# EAGLE design rtc_version1 (EAGLE 5.11)
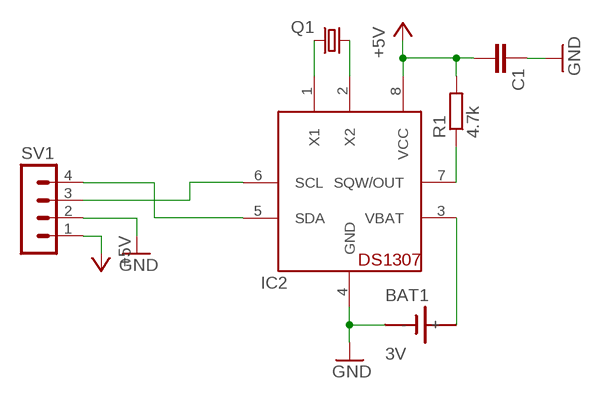
[diagram p0: schematic, sheet 1]

## Parts
BAT1  3V  SN2032  [SN2032]
C1  CAPPTH2  [CAP-PTH-SMALL2]
IC2  DS1307  [DIL08]
Q1  CRYSTALTC38H  [TC38H]
R1  4.7k  R-EU_0207/7  [0207/7]
SV1  MA04-1  [MA04-1]

## Nets
+5V: C1.2 IC2.8(VCC) R1.2 SV1.1
GND: BAT1.- C1.1 IC2.4(GND) SV1.2
N$1: IC2.2(X2) Q1.1
N$2: IC2.1(X1) Q1.2
N$3: BAT1.+ IC2.3(VBAT)
N$5: IC2.7(SQW/OUT) R1.1
SCL: IC2.6(SCL) SV1.3
SDA: IC2.5(SDA) SV1.4

## Library data of the parts
BAT1 = sn2032:SN2032: LI BATTERY
C1 = SparkFun:CAP: Capacitor Standard 0603 ceramic capacitor, and 0.1" leaded capacitor.
IC2 = adafruit:DS1307: DS1307 Real time clock (RTC) with battery backup ability. Talk to it via i2c
Q1 = SparkFun:CRYSTAL: Crystals Various standard crystals. Proven footprints. Spark Fun Electronics SKU : COM-00534
R1 = rcl:R-EU_: RESISTOR, European symbol
SV1 = con-lstb:MA04-1: PIN HEADER; OC_FARNELL: unknown; OC_NEWARK: unknown

## Board
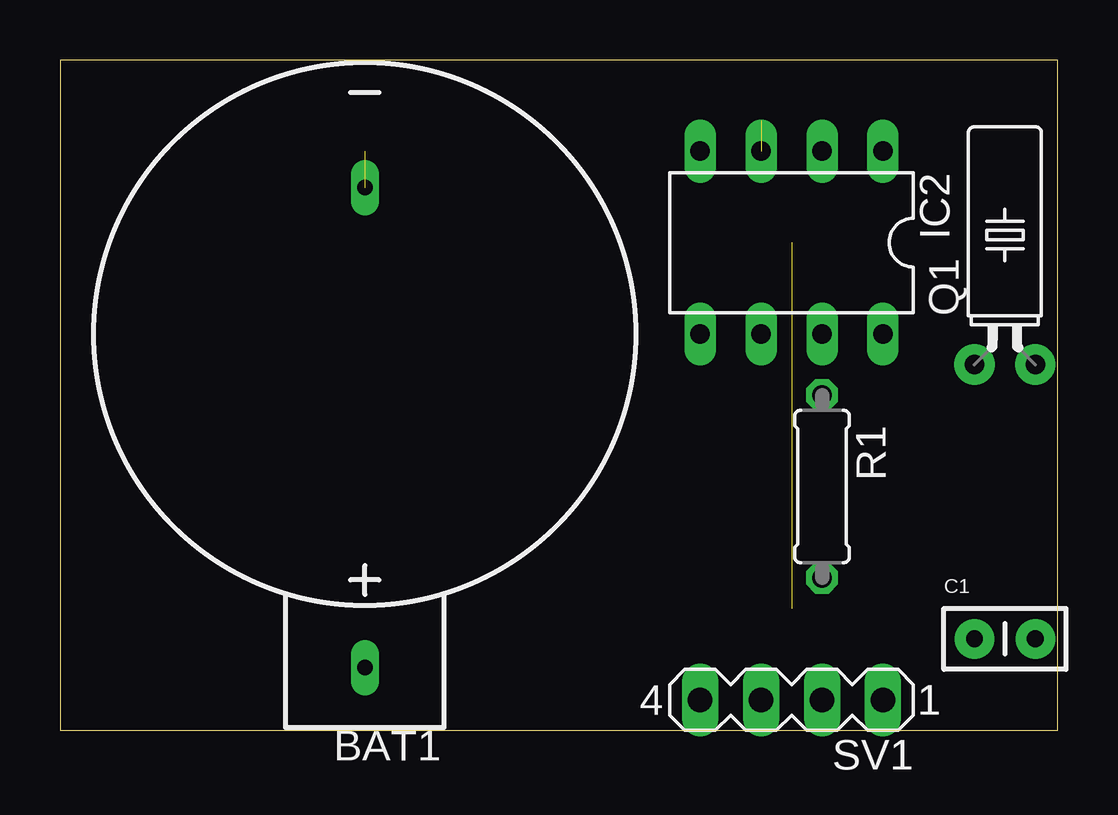
[diagram p1: board, top side]
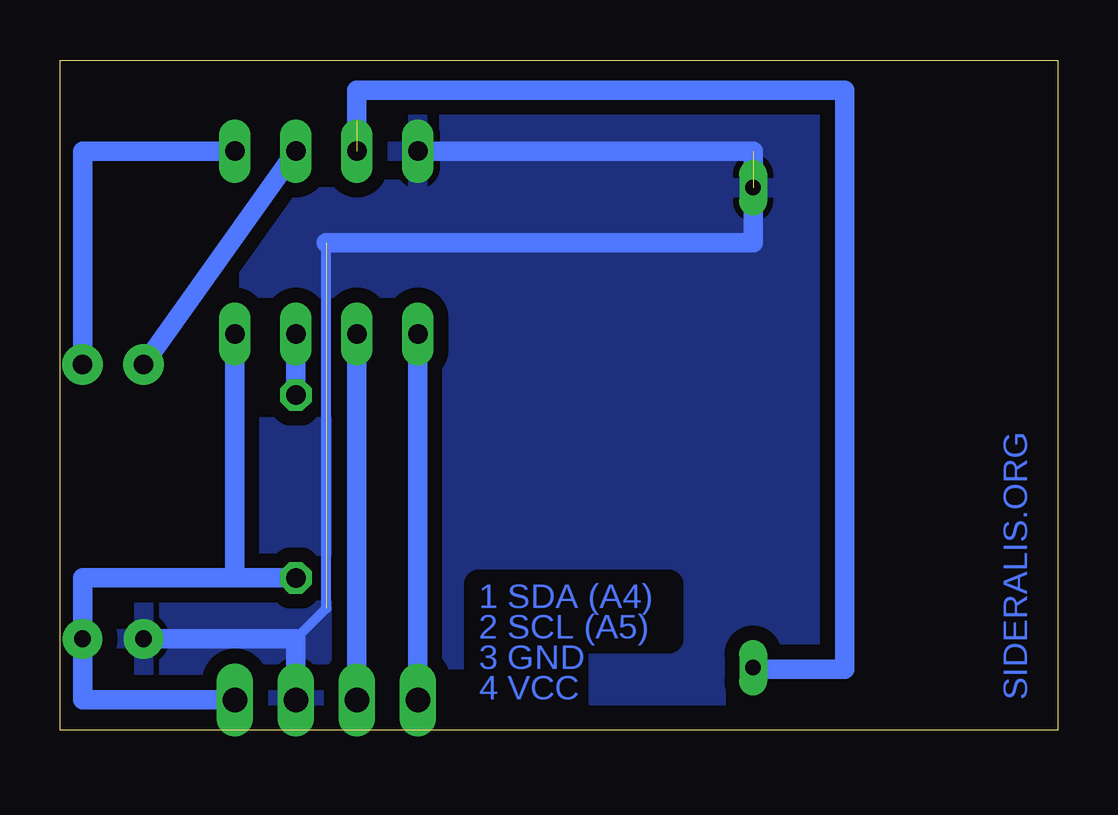
[diagram p2: board, bottom side, seen from below]

Size 41.58 x 27.93 mm. Coordinates in mm from the lower left corner, seen from the top.
Outline: 0,0 41.58,0 41.58,27.93 0,27.93 0,0
Copper layers (1*16): Top 0.035mm / dielectric 1.5mm / Bottom 0.035mm
Design rules "default": minimum track width 10mil, minimum drill 24mil, track to track 8mil, track to pad 8mil, pad to pad 8mil, via to via 8mil, smd to smd 8mil, copper to edge 40mil, drill to drill 8mil, minimum pad ring 10mil, minimum via ring 8mil, stop-mask expansion 4mil, vias tented up to drill 0mil, thermal gap 10mil

### Footprints (pad centres in the part's own frame; a part is rotated, then mirrored left to right if it is on the bottom)
SN2032 = drill 0.65 long: + 0,13.9; - 0,-6.1
CAP-PTH-SMALL2 = drill 0.7 pad 1.651 round: 1 0,0; 2 2.54,0
DIL08 = drill 0.813 long: 1 -3.81,-3.81; 2 -1.27,-3.81; 3 1.27,-3.81; 4 3.81,-3.81; 5 3.81,3.81; 6 1.27,3.81; 7 -1.27,3.81; 8 -3.81,3.81
TC38H = drill 0.813 pad 1.676 round: 1 -1.27,0; 2 1.27,0
0207/7 = drill 0.813 octagon: 1 -3.81,0; 2 3.81,0
MA04-1 = drill 1.016 long: 1 -3.81,0; 2 -1.27,0; 3 1.27,0; 4 3.81,0

### Placement (x,y rotation side)
BAT1  12.7,16.51 180 top
C1  38.1,3.81 0 top
IC2  30.48,20.32 180 top
Q1  39.37,15.24 0 top
R1  31.75,10.16 270 top
SV1  30.48,1.27 180 top

### Tracks (layer width: path | path; a pad name or v marks a point on that pad's centre or on a via)
+5V
  Bottom 0.813: 34.29,6.35 IC2.8 | 34.29,6.35 R1.2 | 34.29,6.35 40.64,6.35 C1.2 40.64,1.27 SV1.1
GND  (2 unrouted)
  Bottom 0.406: 31.75,3.81 30.48,5.08 30.48,20.32
  Bottom 0.813: IC2.4 12.7,24.13 12.7,20.32 30.48,20.32 | SV1.2 31.75,3.81 C1.1
  pour Bottom (isolate 0.61): -8.89,38.1 54.61,38.1 54.61,-7.62 -8.89,-7.62
N$1
  Bottom 0.813: Q1.1 IC2.2
N$2
  Bottom 0.813: IC2.1 40.64,24.13 Q1.2
N$3  (1 unrouted)
  Bottom 0.813: BAT1.+ 12.7,2.54 8.89,2.54 8.89,26.67 29.21,26.67 29.21,25.4
N$5
  Bottom 0.813: R1.1 IC2.7
SCL
  Bottom 0.813: SV1.3 IC2.6
SDA
  Bottom 0.813: SV1.4 IC2.5

### Text on the board
Bottom: 1 SDA (A4) | 2 SCL (A5) | 3 GND | SIDERALIS.ORG | 4 VCC